# EAGLE design Board_Schamatic06 (EAGLE 9.6.2)
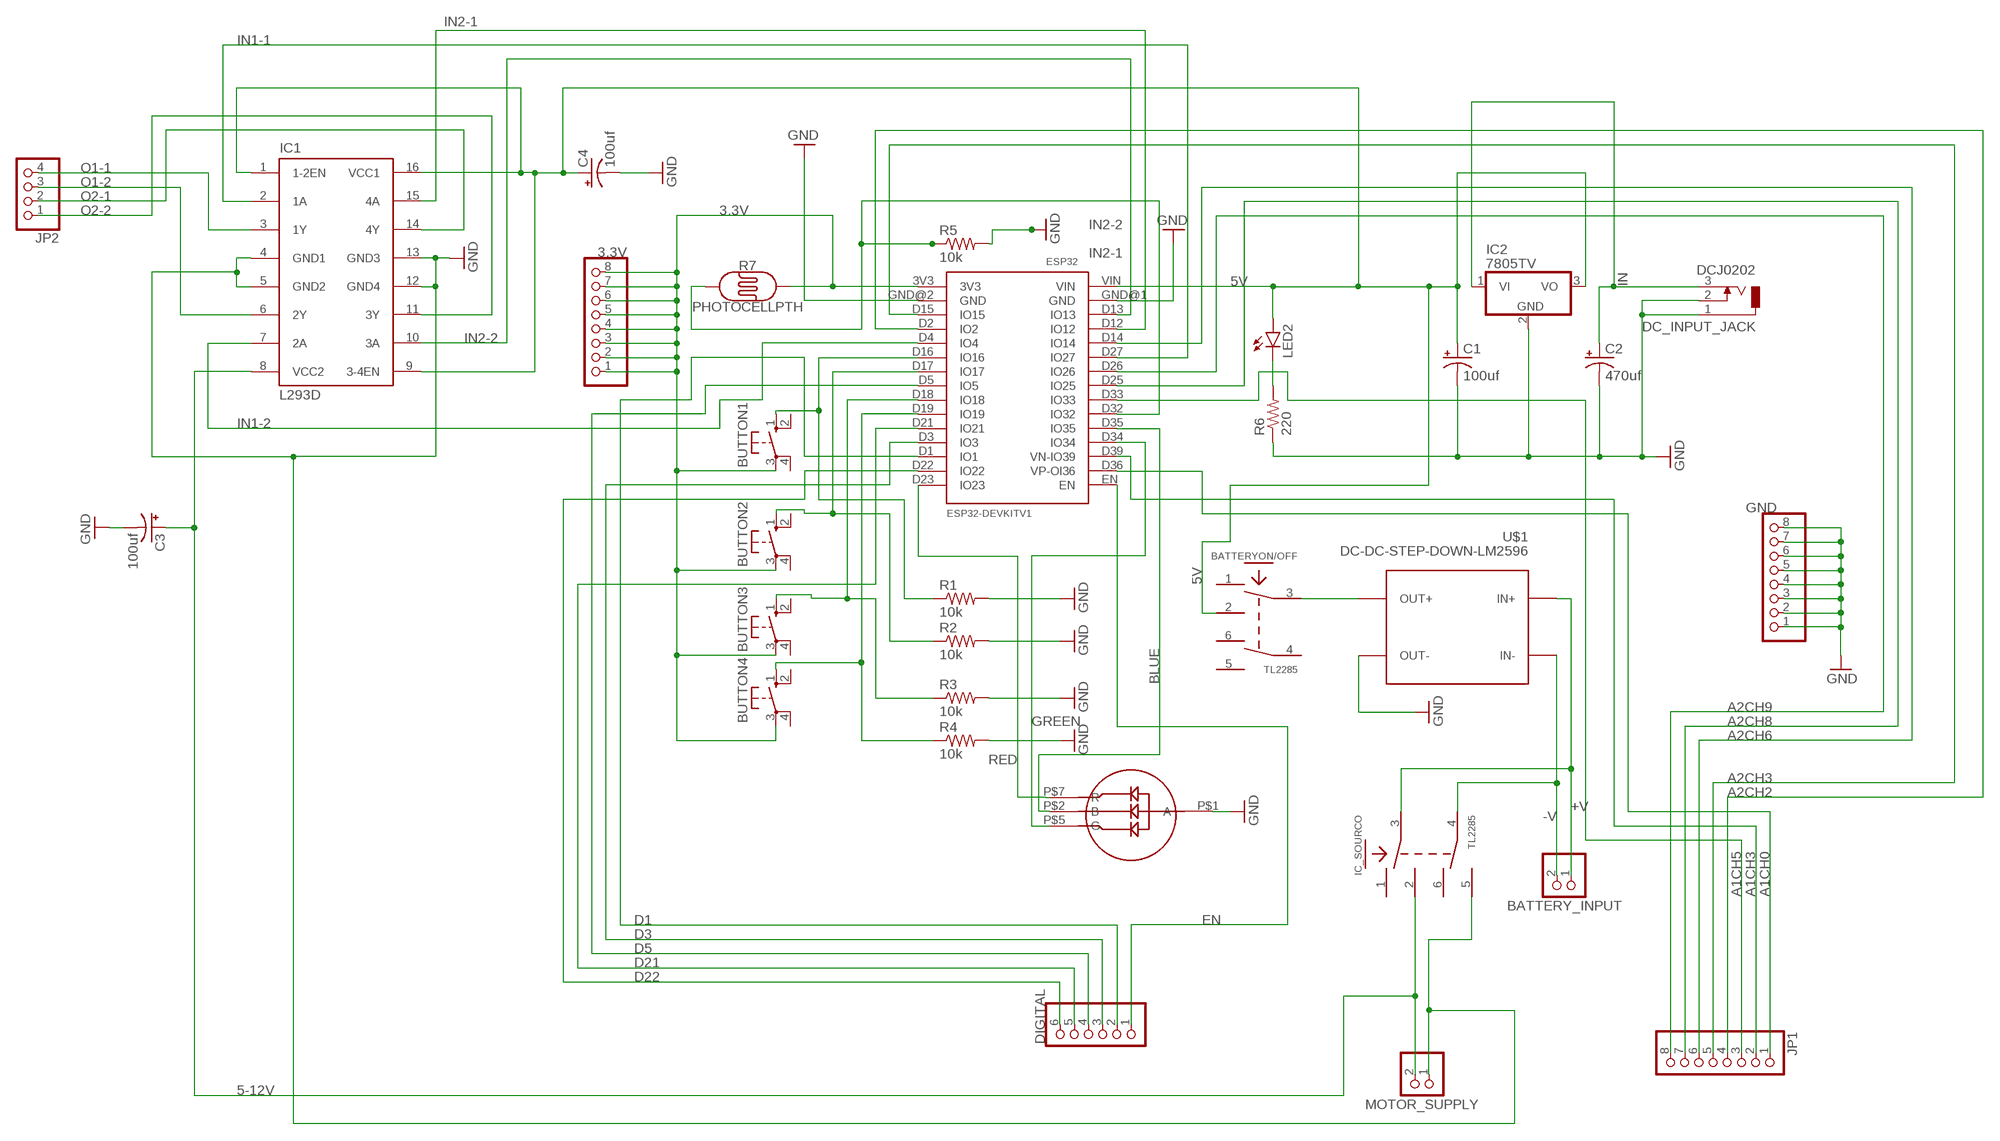
[diagram p0: schematic, sheet 1]

## Parts
3.3V  PINHD-1X8  [1X08]
BATTERY_INPUT  PINHD-1X2  [1X02]
BATTERYON/OFF  TL2285  [TL2285_PCB]
BUTTON1  10-XX  [B3F-10XX]
BUTTON2  10-XX  [B3F-10XX]
BUTTON3  10-XX  [B3F-10XX]
BUTTON4  10-XX  [B3F-10XX]
C1  100uf  CPOL-USE2-5  [E2-5]
C2  470uf  CPOL-USE2-5  [E2-5]
C3  100uf  CPOL-USE2-5  [E2-5]
C4  100uf  CPOL-USE2-5  [E2-5]
DC_INPUT_JACK  DCJ0202  [DCJ0202]
DIGITAL  PINHD-1X6  [1X06]
ESP32  ESP32DEVKITV1  [ESP32-DEVKITV1]
GND  PINHD-1X8  [1X08]
IC1  L293D  [DIL16]
IC2  7805TV  [TO220V]
IC_SOURCO  TL2285  [TL2285_PCB]
JP1  PINHD-1X8  [1X08]
JP2  PINHD-1X4  [1X04]
LED2  LED5MM  [LED5MM]
LED-4_PIN1  LED-4_PIN  [LED-4_PIN]
MOTOR_SUPPLY  PINHD-1X2  [1X02]
R1  10k  R-US_0207/10  [0207/10]
R2  10k  R-US_0207/10  [0207/10]
R3  10k  R-US_0207/10  [0207/10]
R4  10k  R-US_0207/10  [0207/10]
R5  10k  R-US_0207/10  [0207/10]
R6  220  R-US_0207/10  [0207/10]
R7  PHOTOCELLPTH  [PHOTOCELL]
U$1  DC-DC-STEP-DOWN-LM2596  [DC-DC-STEP-DOWN-LM2596]

## Nets
3.3V: 3.3V.1 3.3V.2 3.3V.3 3.3V.4 3.3V.5 3.3V.6 3.3V.7 3.3V.8 BUTTON1.3(P) BUTTON2.3(P) BUTTON3.3(P) BUTTON4.3(P) ESP32.3V3 R7.2
5-12V: C3.+ IC1.8(VCC2) IC_SOURCO.2 MOTOR_SUPPLY.2
5V: BATTERYON/OFF.2 C1.+ C4.+ ESP32.VIN IC1.1(1-2EN) IC1.9(3-4EN) IC1.16(VCC1) IC2.3(VO) LED2.A
+V: BATTERY_INPUT.1 IC_SOURCO.3 U$1.IN+
-V: BATTERY_INPUT.2 IC_SOURCO.4 U$1.IN-
A1CH0: ESP32.D36(VP-OI36) JP1.1
A1CH3: ESP32.D39(VN-IO39) JP1.2
A1CH5: ESP32.D33(IO33) JP1.3
A2CH2: ESP32.D2(IO2) JP1.4
A2CH3: ESP32.D15(IO15) JP1.5
A2CH6: ESP32.D14(IO14) JP1.6
A2CH8: ESP32.D25(IO25) JP1.7
A2CH9: ESP32.D26(IO26) JP1.8
BLUE: ESP32.D35(IO35) LED-4_PIN1.P$2(B)
D1: DIGITAL.2 ESP32.D1(IO1)
D3: DIGITAL.3 ESP32.D3(IO3)
D5: DIGITAL.4 ESP32.D5(IO5)
D21: DIGITAL.5 ESP32.D21(IO21)
D22: DIGITAL.6 ESP32.D22(IO22)
EN: DIGITAL.1 ESP32.EN
GND: C1.- C2.- C3.- C4.- DC_INPUT_JACK.1 DC_INPUT_JACK.2 ESP32.GND@1(GND) ESP32.GND@2(GND) GND.1 GND.2 GND.3 GND.4 GND.5 GND.6 GND.7 GND.8 IC1.4(GND1) IC1.5(GND2) IC1.12(GND4) IC1.13(GND3) IC2.2(GND) IC_SOURCO.5 LED-4_PIN1.P$1(A) MOTOR_SUPPLY.1 R1.2 R2.2 R3.2 R4.2 R5.2 R6.1 U$1.OUT-
GREEN: ESP32.D34(IO34) LED-4_PIN1.P$5(G)
IN: C2.+ DC_INPUT_JACK.3 IC2.1(VI)
IN1-1: ESP32.D27(IO27) IC1.2(1A)
IN1-2: ESP32.D4(IO4) IC1.7(2A)
IN2-1: ESP32.D12(IO12) IC1.15(4A)
IN2-2: ESP32.D13(IO13) IC1.10(3A)
N$2: BATTERYON/OFF.3 U$1.OUT+
N$4: LED2.K(C) R6.2
N$9: ESP32.D32(IO32) R5.1 R7.1
N$10: BUTTON1.1(S) ESP32.D16(IO16) R1.1
N$11: BUTTON2.1(S) ESP32.D17(IO17) R2.1
N$12: BUTTON3.1(S) ESP32.D18(IO18) R3.1
N$13: BUTTON4.1(S) ESP32.D19(IO19) R4.1
O1-1: IC1.3(1Y) JP2.4
O1-2: IC1.6(2Y) JP2.3
O2-1: IC1.14(4Y) JP2.2
O2-2: IC1.11(3Y) JP2.1
RED: ESP32.D23(IO23) LED-4_PIN1.P$7(R)
Unconnected: BATTERYON/OFF.1 BATTERYON/OFF.4 BATTERYON/OFF.5 BATTERYON/OFF.6 BUTTON1.2(S1) BUTTON1.4(P1) BUTTON2.2(S1) BUTTON2.4(P1) BUTTON3.2(S1) BUTTON3.4(P1) BUTTON4.2(S1) BUTTON4.4(P1) IC_SOURCO.1 IC_SOURCO.6

## Library data of the parts
3.3V GND JP1 = pinhead:PINHD-1X8: PIN HEADER
BATTERY_INPUT MOTOR_SUPPLY = pinhead:PINHD-1X2: PIN HEADER
BATTERYON/OFF IC_SOURCO = L71_devices:TL2285: E-Switch TL2285 (PCB switch)
BUTTON1-BUTTON4 = switch-omron:10-XX: OMRON SWITCH; MPN: B3F-1000; OC_FARNELL: 176432; OC_NEWARK: 36M3542
C1-C4 = rcl:CPOL-US: POLARIZED CAPACITOR, American symbol; SPICEPREFIX: C
DC_INPUT_JACK = con-jack:DCJ0202: DC POWER JACK Source: DCJ0202.pdf; OC_FARNELL: unknown; OC_NEWARK: unknown
DIGITAL = pinhead:PINHD-1X6: PIN HEADER
ESP32 = ESP32-DEVKITV1:ESP32DEVKITV1
IC1 = st-microelectronics:L293D: PUSH-PULL 4 CHANNEL DRIVER; MPN: L293D; OC_FARNELL: 9589619; OC_NEWARK: 56P8249
IC2 = linear:78*: Positive VOLTAGE REGULATOR Source: http://cache.national.com/ds/LM/LM78L05.pdf http://www.fairchildsemi.com/ds/LM/LM7805.pdf
JP2 = pinhead:PINHD-1X4: PIN HEADER
LED2 = led:LED: LED OSRAM: - CHIPLED LG R971, LG N971, LY N971, LG Q971, LY Q971, LO R971, LY R971 LH N974, LH R974 LS Q976, LO Q976, LY Q976 LO Q996 - Hyper CHIPLED LW Q18S LB Q993, LB Q99A, LB R99A - SideLED LS A670, LO A670, LY A670, LG A670, LP A670 LB A673, LV A673, LT A673, LW A673 LH A674 LY A675 LS A676, LA A676, LO A676, LY A676, LW A676 LS A679, LY A679, LG A679 - Hyper Micro SIDELED® LS Y876, LA Y876, LO Y876, LY Y876 LT Y87S - SmartLED LW L88C, LW L88S LB L89C, LB L89S, LG L890 LS L89K, LO L89K, LY L89K LS L896, LA L896, LO L896, LY L896 - TOPLED LS T670, LO T670, LY T670, LG T670, LP T670 LSG T670, LSP T670, LSY T670, LOP T670, LYG T670 LG T671, LOG T671, LSG T671 LB T673, LV T673, LT T673, LW T673 LH T674 LS T676, LA T676, LO T676, LY T676, LB T676, LH T676, LSB T676, LW T676 LB T67C, LV T67C, LT T67C, LS T67K, LO T67K, LY T67K, LW E67C LS E67B, LA E67B, LO E67B, LY E67B, LB E67C, LV E67C, LT E67C LW T67C LS T679, LY T679, LG T679 LS T770, LO T770, LY T770, LG T770, LP T770 LB T773, LV T773, LT T773, LW T773 LH T774 LS E675, LA E675, LY E675, LS T675 LS T776, LA T776, LO T776, LY T776, LB T776 LHGB T686 LT T68C, LB T68C - Hyper Mini TOPLED® LB M676 - Mini TOPLED Santana® LG M470 LS M47K, LO M47K, LY M47K Source: http://www.osram.convergy.de LUXEON: - LUMILED® LXK2-PW12-R00, LXK2-PW12-S00, LXK2-PW14-U00, LXK2-PW14-V00 LXK2-PM12-R00, LXK2-PM12-S00, LXK2-PM14-U00 LXK2-PE12-Q00, LXK2-PE12-R00, LXK2-PE12-S00, LXK2-PE14-T00, LXK2-PE14-U00 LXK2-PB12-K00, LXK2-PB12-L00, LXK2-PB12-M00, LXK2-PB14-N00, LXK2-PB14-P00, LXK2-PB14-Q00 LXK2-PR12-L00, LXK2-PR12-M00, LXK2-PR14-Q00, LXK2-PR14-R00 LXK2-PD12-Q00, LXK2-PD12-R00, LXK2-PD12-S00 LXK2-PH12-R00, LXK2-PH12-S00 LXK2-PL12-P00, LXK2-PL12-Q00, LXK2-PL12-R00 Source: www.luxeon.com KINGBRIGHT: KA-3528ASYC Source: www.kingbright.com
LED-4_PIN1 = RGB-Led:LED-4_PIN
R1-R6 = rcl:R-US_: RESISTOR, American symbol; SPICEPREFIX: R
R7 = SparkFun-Sensors:PHOTOCELL: Photocell (Photodetector, Photo Resistor, CdS) This is a very small light sensor. A photocell changes (also called a photodetector, photo resistor, CdS or photoconductive cell) resistance depending on the amount of light it is exposed to. These little sensors make great ambient light triggers (when light in the room turns on, do something). Datasheet <http://cdn.sparkfun.com/datasheets/Sensors/LightImaging/SEN-09088.pdf> SparkFun Products Mini Photocell <https://www.sparkfun.com/products/9088> (SEN-09088); PROD_ID: COMP-09129; SF_ID: SEN-09088
U$1 = diy-modules:DC-DC-STEP-DOWN-LM2596: DC/DC Step-Down Regulator based on LM2596-ADJ chip LM2596 datasheet available here: http://www.ti.com/lit/ds/symlink/lm2596.pdf Click here to find device on ebay.com <http://www.ebay.com/sch/lm2596+power+regulator>

## Board
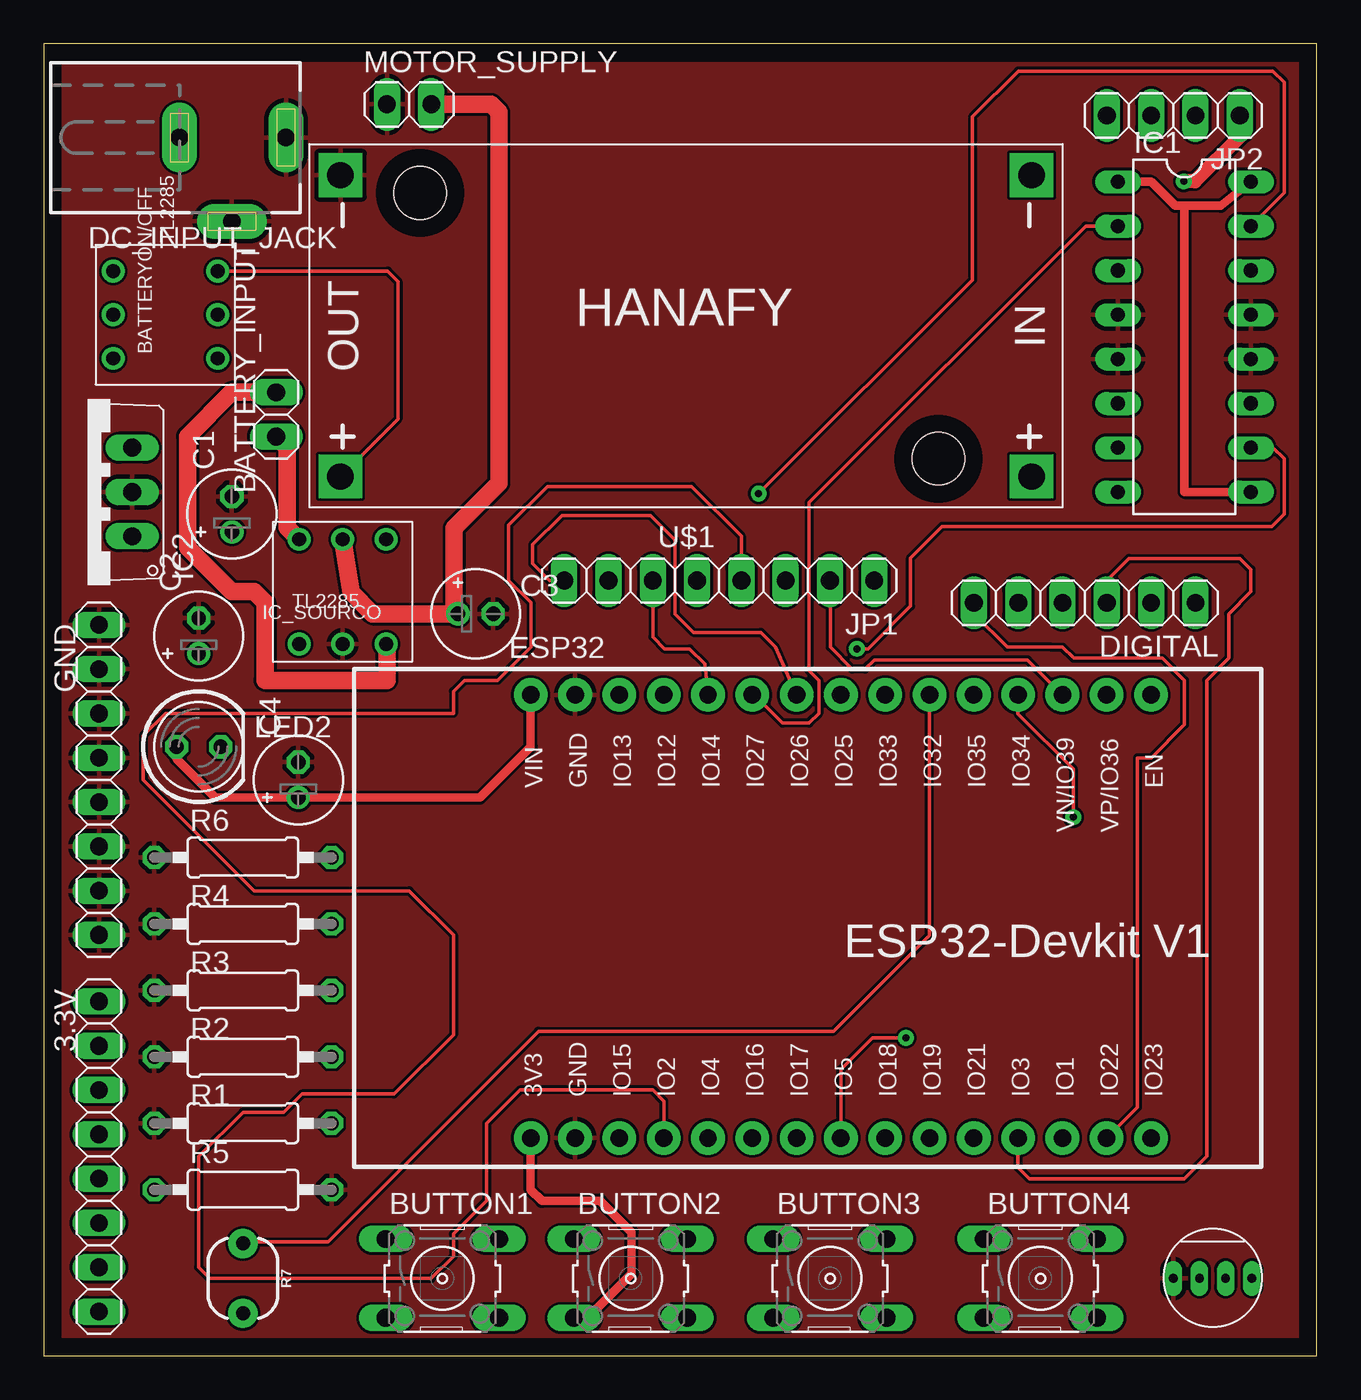
[diagram p1: board, top side]
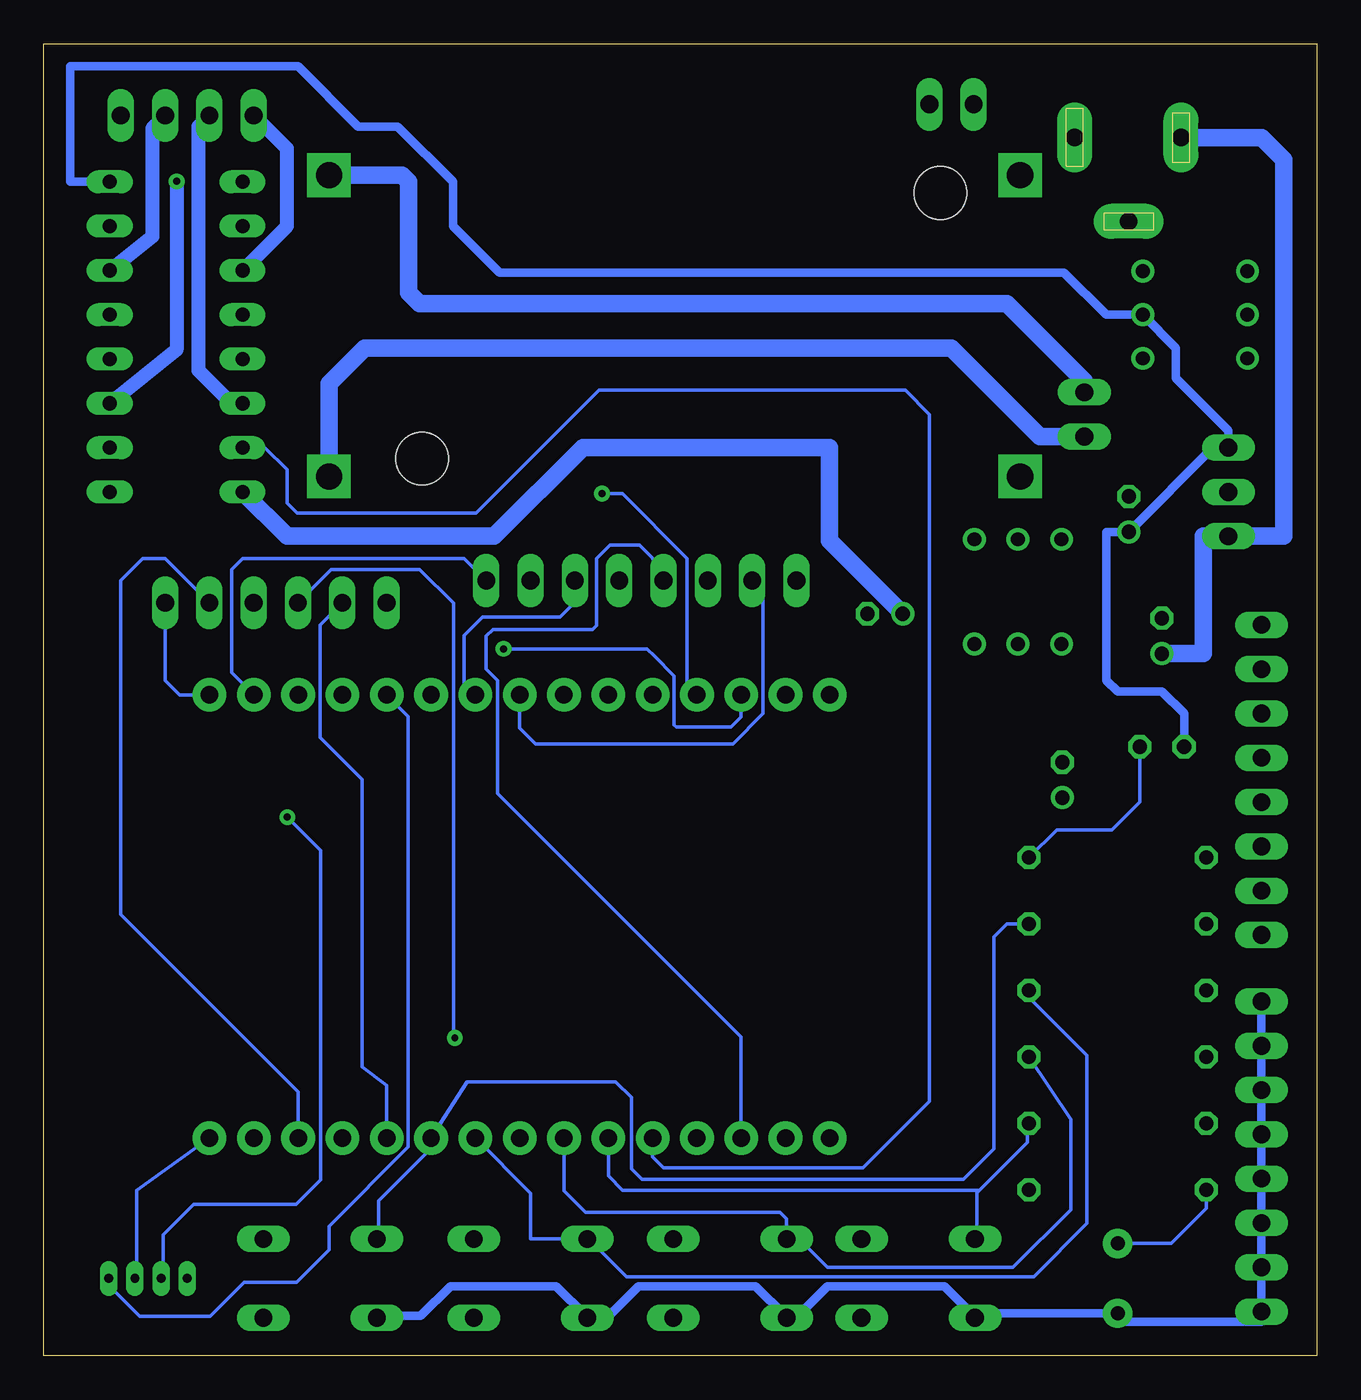
[diagram p2: board, bottom side, seen from below]

Size 73 x 75.23 mm. Coordinates in mm from the lower left corner, seen from the top.
Outline: 0,0 73,0 73,75.23 0,75.23 0,0
Copper layers (1*16): Top 0.035mm / dielectric 1.5mm / Bottom 0.035mm
Design rules "default *": minimum track width 7mil, minimum drill 0.4mm, track to track 6mil, track to pad 6mil, pad to pad 6mil, via to via 6mil, smd to smd 6mil, copper to edge 40mil, drill to drill 6mil, minimum pad ring 10mil, minimum via ring 10mil, stop-mask expansion 4mil, vias tented up to drill 0mil, thermal gap 10mil

### Footprints (pad centres in the part's own frame; a part is rotated, then mirrored left to right if it is on the bottom)
1X08 = drill 1.016 long: 1 -8.89,0; 2 -6.35,0; 3 -3.81,0; 4 -1.27,0; 5 1.27,0; 6 3.81,0; 7 6.35,0; 8 8.89,0
1X02 = drill 1.016 long: 1 -1.27,0; 2 1.27,0
TL2285_PCB = drill 0.8: 1 -2.5,-3; 2 0,-3; 3 2.5,-3; 4 -2.5,3; 5 0,3; 6 2.5,3
B3F-10XX = drill 1.016 long: 1 -3.251,2.261; 2 3.251,2.261; 3 -3.251,-2.261; 4 3.251,-2.261
E2-5 = drill 0.813 pad 1.27: + -1.016,0 | drill 0.813 pad 1.27 octagon: - 1.016,0
DCJ0202 = drill 1 pad 2 long: 1 0,3.1; 2 4.8,0; 3 0,-3
1X06 = drill 1.016 long: 1 -6.35,0; 2 -3.81,0; 3 -1.27,0; 4 1.27,0; 5 3.81,0; 6 6.35,0
ESP32-DEVKITV1 = drill 1 pad 1.93: 3V3 -16.52,-12.27; D1 13.96,-12.27; D2 -8.9,-12.27; D3 11.42,-12.27; D4 -6.36,-12.27; D5 1.26,-12.27; D12 -8.9,13.135; D13 -11.44,13.135; D14 -6.36,13.135; D15 -11.44,-12.27; D16 -3.82,-12.27; D17 -1.28,-12.27; D18 3.8,-12.27; D19 6.34,-12.27; D21 8.88,-12.27; D22 16.5,-12.27; D23 19.04,-12.27; D25 1.26,13.135; D26 -1.28,13.135; D27 -3.82,13.135; D32 6.34,13.135; D33 3.8,13.135; D34 11.42,13.135; D35 8.88,13.135; D36 16.5,13.135; D39 13.96,13.135; EN 19.04,13.135; GND@1 -13.98,13.135; GND@2 -13.98,-12.27; VIN -16.52,13.135
DIL16 = drill 0.813 long: 1 -8.89,-3.81; 2 -6.35,-3.81; 3 -3.81,-3.81; 4 -1.27,-3.81; 5 1.27,-3.81; 6 3.81,-3.81; 7 6.35,-3.81; 8 8.89,-3.81; 9 8.89,3.81; 10 6.35,3.81; 11 3.81,3.81; 12 1.27,3.81; 13 -1.27,3.81; 14 -3.81,3.81; 15 -6.35,3.81; 16 -8.89,3.81
TO220V = drill 1.016 long: 1 -2.54,-2.54; 2 0,-2.54; 3 2.54,-2.54
1X04 = drill 1.016 long: 1 -3.81,0; 2 -1.27,0; 3 1.27,0; 4 3.81,0
LED5MM = drill 0.813 octagon: A -1.27,0; K 1.27,0
LED-4_PIN = drill 0.5 long: P$1 0,0; P$2 0,4.5; P$5 0,1.5; P$7 0,3
0207/10 = drill 0.813 octagon: 1 -5.08,0; 2 5.08,0
PHOTOCELL = drill 0.8 pad 1.676: 1 -2,0; 2 2,0
DC-DC-STEP-DOWN-LM2596 = drill 1.5 pad 2.5 square: IN+ -19.812,8.636; IN- -19.812,-8.636; OUT+ 19.812,8.636; OUT- 19.812,-8.636 | hole 3: -14.478,7.62; 15.24,-7.62

### Placement (x,y rotation side)
3.3V  3.17,11.43 270 top
BATTERY_INPUT  13.34,53.98 90 top
BATTERYON/OFF  6.99,59.69 90 top
BUTTON1  22.86,4.45 0 top
BUTTON2  33.66,4.45 0 top
BUTTON3  45.09,4.45 0 top
BUTTON4  57.15,4.45 0 top
C1  10.79,48.26 90 top
C2  8.89,41.27 90 top
C3  24.77,42.55 0 top
C4  14.61,33.02 90 top
DC_INPUT_JACK  10.79,69.85 270 top
DIGITAL  59.69,43.18 180 top
ESP32  44.45,24.77 0 top
GND  3.17,33.02 270 top
IC1  65.41,58.42 270 top
IC2  2.54,49.53 90 top
IC_SOURCO  17.14,43.81 180 top
JP1  38.73,44.45 180 top
JP2  64.77,71.12 180 top
LED2  8.89,34.92 0 top
LED-4_PIN1  64.77,4.45 270 top
MOTOR_SUPPLY  20.95,71.75 0 top
R1  11.43,13.34 180 top
R2  11.43,17.14 180 top
R3  11.43,20.95 180 top
R4  11.43,24.77 180 top
R5  11.43,9.53 0 top
R6  11.43,28.57 0 top
R7  11.43,4.45 270 top
U$1  36.83,59.05 180 top

### Tracks (layer width: path | path; a pad name or v marks a point on that pad's centre or on a via)
3.3V
  Top 0.5: BUTTON2.3 31.19,2.18 33.72,4.71 33.72,7.1 31.91,8.9 31.9,8.89 28.57,8.89 27.93,9.54 ESP32.3V3
  Bottom 0.5: 3.2,15.24 3.2,17.68 3.3V.2 3.2,17.83 3.2,20.27 3.3V.1 | 3.2,7.62 3.2,5.18 3.3V.7 3.2,5.03 3.2,2.59 | BUTTON4.3 53.8,2.29 51.38,2.29 49.68,3.99 43.61,3.99 41.91,2.29 BUTTON3.3 41.76,2.29 40.59,2.29 38.89,3.99 32.18,3.99 30.48,2.29 BUTTON2.3 30.33,2.29 29.77,2.29 28.07,3.99 21.36,3.99 19.66,2.29 BUTTON1.3 19.35,2.44 R7.2 10.94,1.96 3.2,1.96 3.2,2.59 | 3.2,2.59 3.3V.8 | 3.2,7.62 3.2,10.06 3.3V.5 3.2,10.21 3.2,12.65 3.3V.4 3.2,12.8 3.2,15.24 | 3.2,7.62 3.3V.6 | 3.2,15.24 3.3V.3
5-12V
  Top 0.813: 23.55,42.75 C3.+
  Top 1: IC_SOURCO.2 17.62,43.79 18.86,42.55 C3.+ | MOTOR_SUPPLY.2 25.65,71.75 26.11,71.3 26.11,50.04 23.55,47.47 23.55,42.75
  Bottom 1: IC1.8 59.05,46.99 47.17,46.99 42.09,52.07 27.94,52.07 27.94,46.74 C3.+
5V
  Top 0.5: 65.41,65.94 67.5,65.94 IC1.16 | 65.41,65.94 64.87,65.94 63.5,67.31 IC1.1 | LED2.A 7.62,34.21 9.83,32 C4.+ 25.02,32 27.93,34.91 ESP32.VIN | 65.41,65.94 65.41,49.53 IC1.9
  Bottom 0.5: IC1.16 71.49,67.31 71.49,73.94 58.42,73.94 54.97,70.48 52.7,70.48 49.53,67.31 49.53,64.77 46.86,62.1 14.5,62.1 12.09,59.69 BATTERYON/OFF.2 8.08,57.78 8.08,56.05 5.08,53.05 IC2.3 5.97,52.07 C1.+ 12.06,47.24 12.06,38.73 11.43,38.1 8.89,38.1 7.62,36.83 LED2.A
+V
  Top 1: BATTERY_INPUT.1 13.97,52.07 13.97,47.49 IC_SOURCO.3
  Bottom 1: U$1.IN+ 56.64,55.75 54.61,57.78 20.95,57.78 15.88,52.7 BATTERY_INPUT.1
-V
  Top 1: BATTERY_INPUT.2 10.79,55.24 8.26,52.7 8.26,46.35 10.79,43.81 12.06,43.81 12.7,43.18 12.7,38.73 19.68,38.73 19.68,40.77 IC_SOURCO.4
  Bottom 1: U$1.IN- 52.45,67.69 52.07,67.31 52.07,60.96 51.44,60.33 17.78,60.33 13.34,55.88 BATTERY_INPUT.2
A1CH0
  Bottom 0.203: JP1.1 48.9,45.72 61.59,45.72 62.23,45.09 62.23,39.18 ESP32.D36
A1CH3
  Top 0.203: JP1.2 45.11,44.42 45.11,40.64 45.1,40.63 46.35,39.37 47.09,39.37 47.62,39.9 56.41,39.9 ESP32.D39
A1CH5
  Bottom 0.203: ESP32.D33 48.88,38.53 48.88,41.31 47.83,42.37 43.38,42.37 42.55,43.2 JP1.3
A2CH2
  Top 0.203: ESP32.D2 35.56,14.61 34.92,15.24 27.3,15.24 25.4,13.34 25.4,8.89 23.5,6.99 23.5,5.71 22.23,4.45 9.53,4.45 8.89,5.08 8.89,11.43 11.43,13.97 13.77,13.97 14.81,15.01 20.09,15.01 23.5,18.41 23.5,24.13 20.95,26.67 12.06,26.67 5.71,33.02 5.71,35.56 6.99,36.83 23.5,36.83 23.5,38.1 24.13,38.73 26.04,38.73 27.94,40.64 27.94,43.18 26.67,44.45 26.67,47.62 28.89,49.85 37.15,49.85 40.01,46.99 JP1.4
A2CH3
  Bottom 0.203: ESP32.D15 33.01,18.28 46.99,32.26 46.99,38.73 47.62,39.37 47.62,41.27 47.24,41.66 46.35,41.66 45.67,41.66 42.09,41.66 41.53,41.66 41.3,41.88 41.3,41.94 41.3,45.72 40.54,46.48 38.84,46.48 38.12,45.77 JP1.5
A2CH6
  Top 0.203: ESP32.D14 37.91,39.66 37.03,40.54 35.61,40.54 34.92,41.22 JP1.6
A2CH8
  Bottom 0.203: ESP32.D25 45.71,36.01 44.79,35.09 33.49,35.09 31.75,36.83 31.75,43.81 JP1.7
A2CH9
  Top 0.203: ESP32.D26 41.95,40.65 41.12,41.48 37.26,41.48 36.2,42.55 36.2,46.79 34.8,48.18 29.72,48.18 28.04,46.51 28.04,45.72 28.04,45.41 29.01,44.45 JP1.8
BLUE
  Bottom 0.203: ESP32.D35 52.09,36.66 52.09,11.99 56.64,7.44 56.64,6.07 58.5,4.22 61.49,4.22 63.45,2.26 67.49,2.26 69.19,3.96 69.19,4.42 LED-4_PIN1.P$2
D1
  Bottom 0.203: DIGITAL.2 66.04,45.72 67.31,45.72 68.58,44.45 68.58,25.31 58.41,15.14 ESP32.D1
D3
  Top 0.203: ESP32.D3 55.87,10.8 56.52,10.16 65.41,10.16 66.67,11.43 66.67,38.73 67.94,40.01 67.94,42.55 69.22,43.81 69.22,45.09 68.58,45.72 62.23,45.72 60.96,44.45 DIGITAL.3
D5  (via drill 0.4)
  Top 0.203: v49.43,18.24 47.52,18.24 45.71,16.42 45.71,15.88 ESP32.D5
  Bottom 0.203: v49.43,18.24 49.51,18.31 49.51,40.01 49.51,43.16 51.44,45.09 56.52,45.09 DIGITAL.4
D21
  Bottom 0.203: ESP32.D21 53.33,15.51 54.74,16.58 54.74,33.05 56.57,34.87 57.15,35.46 57.15,41.91 DIGITAL.5
D22
  Top 0.203: ESP32.D22 62.71,14.26 62.71,34.29 63.5,34.29 65.41,36.2 65.41,38.73 64.14,40.01 59.05,40.01 58.42,40.64 57.78,40.64 55.24,40.64 53.34,42.55 DIGITAL.6
EN
  Bottom 0.203: DIGITAL.1 66.04,38.73 65.2,37.9 ESP32.EN
GND
  pour Top: 0,74.3 0,0 73.03,0 73.03,74.3
GREEN  (via drill 0.4)
  Top 0.203: v59.03,30.89 59.03,33.66 55.87,36.81 ESP32.D34
  Bottom 0.203: v59.03,30.89 57.12,28.98 57.12,10.08 58.52,8.69 64.39,8.69 66.14,6.93 66.14,4.57 LED-4_PIN1.P$5
IN
  Bottom 1: C2.+ 6.53,40.26 6.53,46.99 IC2.1 1.91,46.99 1.91,68.58 3.17,69.85 DC_INPUT_JACK.3
IN1-1
  Top 0.203: IC1.2 59.74,64.77 43.89,48.92 43.89,39.29 44.45,38.73 44.45,36.83 43.89,36.27 42.37,36.27 40.69,37.95 ESP32.D27
IN1-2
  Bottom 0.203: ESP32.D4 38.09,11.42 37.47,10.79 26.04,10.79 22.23,14.61 22.23,40.64 22.23,53.98 23.61,55.36 31.64,55.36 31.65,55.37 41.15,55.37 48.21,48.31 57.78,48.31 58.47,48.31 59.05,48.9 59.05,50.8 60.33,52.07 IC1.7
IN2-1  (via drill 0.4)
  Top 0.203: v41,49.43 53.25,61.68 53.25,71.03 55.88,73.66 70.48,73.66 71.12,73.03 71.12,66.67 IC1.15
  Bottom 0.203: v41,49.43 39.83,49.43 36.12,45.72 36.12,43.13 36.12,38.47 ESP32.D12
IN2-2  (via drill 0.4)
  Top 0.203: v46.63,40.54 47.27,40.54 49.71,42.98 49.71,45.74 51.51,47.55 70.41,47.55 71.12,48.26 71.12,51.44 70.48,52.07 IC1.10
  Bottom 0.203: ESP32.D13 33.01,36.63 33.6,36.04 36.73,36.04 36.85,36.17 36.85,38.99 37.99,40.12 38.41,40.54 38.99,40.54 v46.63,40.54
N$2
  Top 0.203: BATTERYON/OFF.3 19.73,62.19 20.32,61.59 20.32,53.72 U$1.OUT+
N$4
  Bottom 0.203: R6.2 14.92,30.16 11.75,30.16 10.16,31.75 LED2.K
N$9
  Top 0.203: R7.1 11.43,6.55 16.31,6.55 28.37,18.62 45.29,18.62 50.79,24.12 ESP32.D32
  Bottom 0.203: R5.1 6.35,8.46 8.36,6.45 R7.1
N$10
  Bottom 0.203: 19.36,9.5 19.51,9.35 19.51,6.71 BUTTON1.1 | 19.36,9.5 16.61,12.24 16.61,13.26 R1.1 | ESP32.D16 40.63,10.33 39.8,9.5 19.36,9.5
N$11
  Bottom 0.203: R2.1 14.12,13.56 14.12,8.38 17.42,5.08 28.07,5.08 29.69,6.71 BUTTON2.1 30.4,7.62 30.4,7.85 30.8,8.24 41.95,8.24 43.17,9.46 ESP32.D17
N$12
  Bottom 0.203: R3.1 16.46,20.88 16.46,20.5 13.18,17.22 13.18,7.59 16.23,4.55 39.6,4.55 41.76,6.71 BUTTON3.1 45.08,6.71 45.08,9.32 ESP32.D18
N$13
  Bottom 0.203: R4.1 17.78,24.77 18.52,24.03 18.52,11.86 20.27,10.11 38.68,10.11 39.31,10.73 39.31,14.82 40.21,15.72 48.72,15.72 ESP32.D19 50.79,11.9 53.8,8.89 53.8,6.71 BUTTON4.1
O1-1
  Bottom 0.813: IC1.3 59.05,64.77 59.05,69.22 JP2.4
O1-2
  Bottom 0.61: 62.23,54.61 IC1.6
  Bottom 0.813: JP2.3 64.14,70.48 64.14,56.52 62.23,54.61
O2-1
  Bottom 0.813: JP2.2 66.78,70.38 66.78,64.18 IC1.14
O2-2  (via drill 0.4)
  Top 0.813: JP2.1 68.58,69.9 66.02,67.33 v65.38,67.33
  Bottom 0.813: v65.38,67.33 65.38,57.68 IC1.11
RED
  Bottom 0.203: LED-4_PIN1.P$7 67.67,4.57 67.67,9.48 ESP32.D23

### Text on the board
tPlace: HANAFY